# EAGLE design UM6650C (EAGLE 9.6.2)
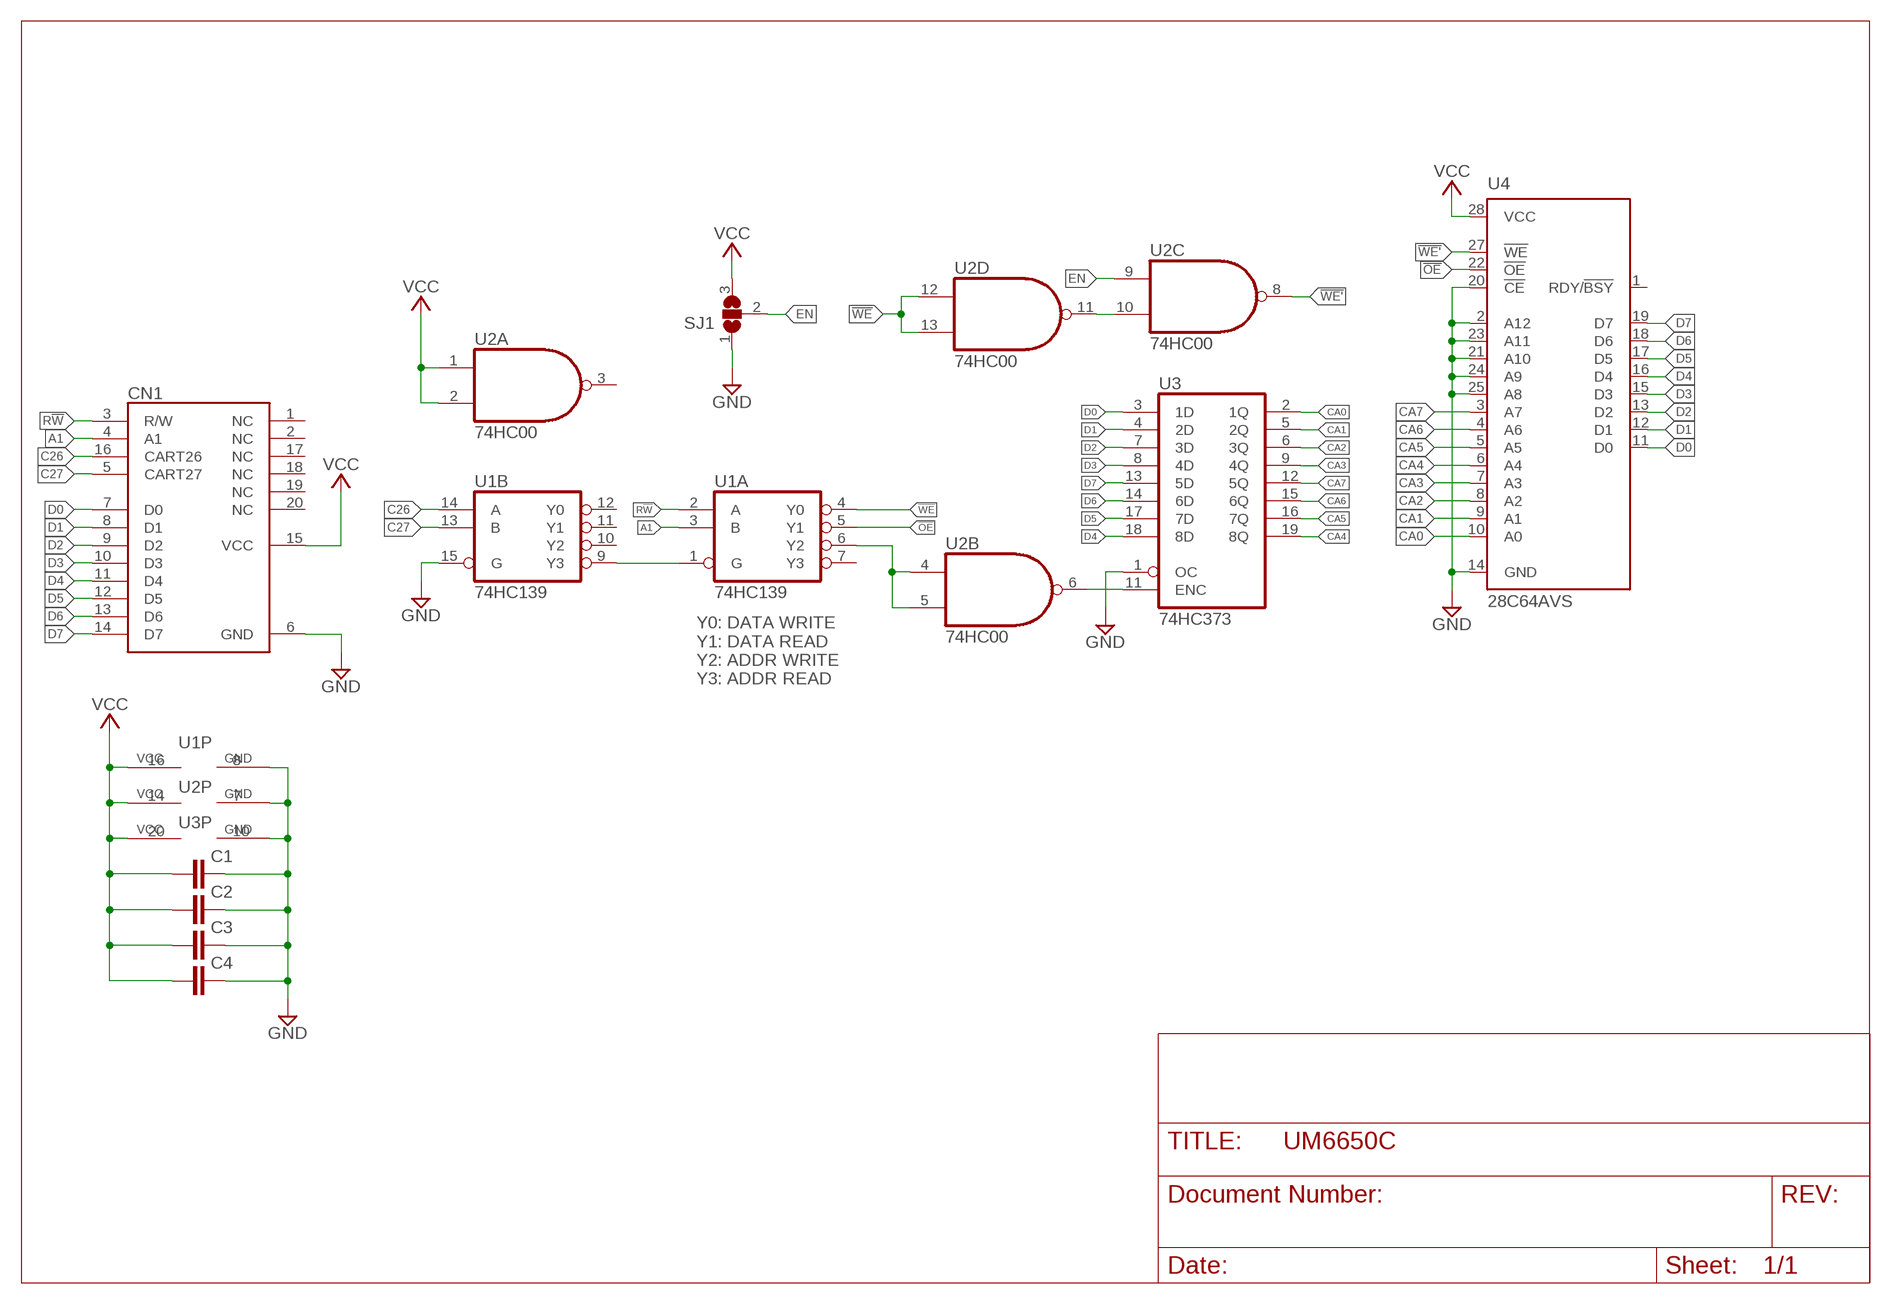
[diagram p0: schematic, sheet 1]

## Parts
C1  C-EUC0603  [C0603]
C2  C-EUC0603  [C0603]
C3  C-EUC0603  [C0603]
C4  C-EUC0603  [C0603]
CN1  UM6650  [DIL20]
SJ1  SJ2W  [SJ_2]
U1  74HC139  74139PW  [TSSOP16]
U2  74HC00  7400PW  [TSSOP14]
U3  74HC373  74373PW  [TSSOP20]
U4  28C64AVS  [VSOP28-8X13]

## Nets
!OE: U1.5(A:Y1) U4.22(!OE)
!WE: U1.4(A:Y0) U2.12(D:I0) U2.13(D:I1)
!WE': U2.8(C:O) U4.27(!WE)
A1: CN1.4(A1) U1.3(A:B)
C26: CN1.16(CART26) U1.14(B:A)
C27: CN1.5(CART27) U1.13(B:B)
CA0: U3.2(1Q) U4.10(A0)
CA1: U3.5(2Q) U4.9(A1)
CA2: U3.6(3Q) U4.8(A2)
CA3: U3.9(4Q) U4.7(A3)
CA4: U3.19(8Q) U4.6(A4)
CA5: U3.16(7Q) U4.5(A5)
CA6: U3.15(6Q) U4.4(A6)
CA7: U3.12(5Q) U4.3(A7)
D0: CN1.7(D0) U3.3(1D) U4.11(D0)
D1: CN1.8(D1) U3.4(2D) U4.12(D1)
D2: CN1.9(D2) U3.7(3D) U4.13(D2)
D3: CN1.10(D3) U3.8(4D) U4.15(D3)
D4: CN1.11(D4) U3.18(8D) U4.16(D4)
D5: CN1.12(D5) U3.17(7D) U4.17(D5)
D6: CN1.13(D6) U3.14(6D) U4.18(D6)
D7: CN1.14(D7) U3.13(5D) U4.19(D7)
EN: SJ1.2 U2.9(C:I0)
GND: C1.2 C2.2 C3.2 C4.2 CN1.6(GND) SJ1.1 U1.8(P:GND) U1.15(B:G) U2.7(P:GND) U3.1(OC) U3.10(GND) U4.2(A12) U4.14(GND) U4.20(!CE) U4.21(A10) U4.23(A11) U4.24(A9) U4.25(A8)
N$1: U2.10(C:I1) U2.11(D:O)
N$2: U1.1(A:G) U1.9(B:Y3)
N$3: U1.6(A:Y2) U2.4(B:I0) U2.5(B:I1)
N$5: U2.6(B:O) U3.11(ENC)
R!W: CN1.3(R/W) U1.2(A:A)
VCC: C1.1 C2.1 C3.1 C4.1 CN1.15(VCC) SJ1.3 U1.16(P:VCC) U2.1(A:I0) U2.2(A:I1) U2.14(P:VCC) U3.20(VCC) U4.28(VCC)
Unconnected: CN1.1(NC) CN1.2(NC) CN1.17(NC) CN1.18(NC) CN1.19(NC) CN1.20(NC) U1.7(A:Y3) U1.10(B:Y2) U1.11(B:Y1) U1.12(B:Y0) U2.3(A:O) U4.1(RDY/!BSY)

## Notes on the sheet
- Y0: DATA WRITE
  Y1: DATA READ
  Y2: ADDR WRITE
  Y3: ADDR READ

## Library data of the parts
C1-C4 = rcl:C-EU: CAPACITOR, European symbol; SPICEPREFIX: C
CN1 = acan:UM6650: UM6650
SJ1 = jumper:SJ2W: SMD solder JUMPER
U1 = 74xx-us:74*139: Dual 2-line to 4-line DECODER/DEMULTIPLEXER
U2 = 74xx-us:74*00: Quad 2-input NAND gate
U3 = 74xx-us:74*373: Octal D type transparent LATCH, edge triggered
U4 = microchip:28*64A: CMOS EEPROM 64 K (8 K x 8), low voltage; OC_FARNELL: unknown; OC_NEWARK: unknown

## Board
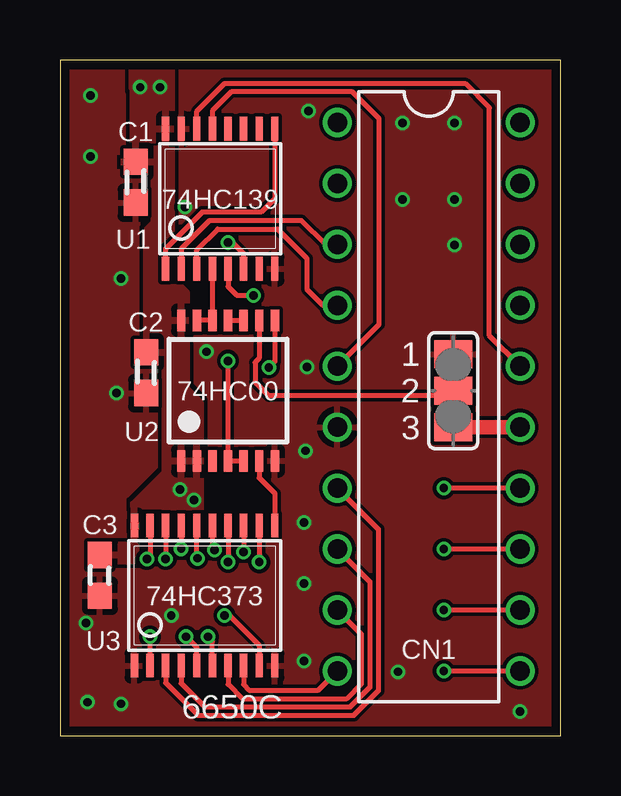
[diagram p1: board, top side]
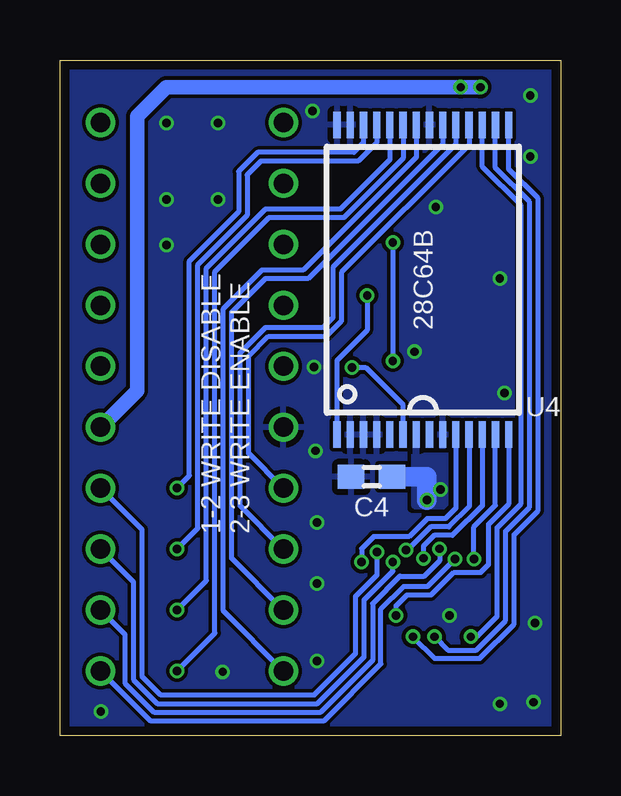
[diagram p2: board, bottom side, seen from below]

Size 20.86 x 28.16 mm. Coordinates in mm from the lower left corner, seen from the top.
Outline: 0,0 20.86,0 20.86,28.16 0,28.16 0,0
Copper layers (1*16): Top 0.035559375mm / dielectric 1.6mm / Bottom 0.035559375mm
Design rules "oshpark-2layer *": minimum track width 6mil, minimum drill 10mil, track to track 6mil, track to pad 6mil, pad to pad 6mil, via to via 6mil, smd to smd 6mil, copper to edge 15mil, drill to drill 6mil, minimum pad ring 5mil, minimum via ring 5mil, stop-mask expansion 2.5mil, vias tented up to drill 10mil, thermal gap 10mil

### Footprints (pad centres in the part's own frame; a part is rotated, then mirrored left to right if it is on the bottom)
C0603 = smd 1.1 x 1: 1 -0.85,0; 2 0.85,0
DIL20 = drill 0.813: 1 -11.43,-3.81; 2 -8.89,-3.81; 3 -6.35,-3.81; 4 -3.81,-3.81; 5 -1.27,-3.81; 6 1.27,-3.81; 7 3.81,-3.81; 8 6.35,-3.81; 9 8.89,-3.81; 10 11.43,-3.81; 11 11.43,3.81; 12 8.89,3.81; 13 6.35,3.81; 14 3.81,3.81; 15 1.27,3.81; 16 -1.27,3.81; 17 -3.81,3.81; 18 -6.35,3.81; 19 -8.89,3.81; 20 -11.43,3.81
SJ_2 = smd 1.168 x 1.6: 1 -1.524,0; 2 0,0; 3 1.524,0
TSSOP16 = smd 0.305 x 0.991: 1 -2.275,-2.918; 2 -1.625,-2.918; 3 -0.975,-2.918; 4 -0.325,-2.918; 5 0.325,-2.918; 6 0.975,-2.918; 7 1.625,-2.918; 8 2.275,-2.918; 9 2.275,2.918; 10 1.625,2.918; 11 0.975,2.918; 12 0.325,2.918; 13 -0.325,2.918; 14 -0.975,2.918; 15 -1.625,2.918; 16 -2.275,2.918
TSSOP14 = smd 0.35 x 0.9: 1 -1.95,-2.925; 2 -1.3,-2.925; 3 -0.65,-2.925; 4 0,-2.925; 5 0.65,-2.925; 6 1.3,-2.925; 7 1.95,-2.925; 8 1.95,2.925; 9 1.3,2.925; 10 0.65,2.925; 11 0,2.925; 12 -0.65,2.925; 13 -1.3,2.925; 14 -1.95,2.925
TSSOP20 = smd 0.305 x 0.991: 1 -2.925,-2.918; 2 -2.275,-2.918; 3 -1.625,-2.918; 4 -0.975,-2.918; 5 -0.325,-2.918; 6 0.325,-2.918; 7 0.975,-2.918; 8 1.625,-2.918; 9 2.275,-2.918; 10 2.925,-2.918; 11 2.925,2.918; 12 2.275,2.918; 13 1.625,2.918; 14 0.975,2.918; 15 0.325,2.918; 16 -0.325,2.918; 17 -0.975,2.918; 18 -1.625,2.918; 19 -2.275,2.918; 20 -2.925,2.918
VSOP28-8X13 = smd 0.3 x 1.1: 1 0.275,-6.45; 2 0.825,-6.45; 3 1.375,-6.45; 4 1.925,-6.45; 5 2.475,-6.45; 6 3.025,-6.45; 7 3.575,-6.45; 8 3.575,6.45; 9 3.025,6.45; 10 2.475,6.45; 11 1.925,6.45; 12 1.375,6.45; 13 0.825,6.45; 14 0.275,6.45; 15 -0.275,6.45; 16 -0.825,6.45; 17 -1.375,6.45; 18 -1.925,6.45; 19 -2.475,6.45; 20 -3.025,6.45; 21 -3.575,6.45; 22 -3.575,-6.45; 23 -3.025,-6.45; 24 -2.475,-6.45; 25 -1.925,-6.45; 26 -1.375,-6.45; 27 -0.825,-6.45; 28 -0.275,-6.45

### Placement (x,y rotation side)
C1  3.15,23.07 270 top
C2  3.59,15.13 270 top
C3  1.66,6.68 270 top
C4  7.89,10.78 180 bottom
CN1  15.37,14.13 270 top
SJ1  16.38,14.38 270 top
U1  6.67,22.38 0 top
U2  7,14.38 0 top
U3  6.03,5.84 0 top
U4  5.75,19 0 bottom

### Tracks (layer width: path | path; a pad name or v marks a point on that pad's centre or on a via)
!OE  (via drill 0.35)
  Top 0.2: U1.5 7,18.72 7.37,18.35 v8.06,18.35
  Bottom 0.2: U4.22 9.32,15.64 8.06,16.9 v8.06,18.35
!WE
  Top 0.2: U1.4 U2.12 U2.13
!WE'  (via drill 0.35)
  Top 0.2: U2.8 8.95,15.6 v8.7,15.35
  Bottom 0.2: U4.27 6.57,13.79 8.13,15.35 v8.7,15.35
A1
  Top 0.2: U1.3 5.7,20.24 6.57,21.11 9.07,21.11 10.29,19.89 10.29,18.61 10.96,17.94 CN1.4
C26
  Top 0.2: U1.14 5.7,26.02 6.86,27.18 16.88,27.18 17.89,26.16 17.89,16.68 CN1.16
C27
  Top 0.2: U1.13 6.35,26.04 7.14,26.83 12.18,26.83 13.29,25.71 13.29,17.14 CN1.5
CA0  (via drill 0.35)
  Top 0.2: U3.2 v3.75,4.13
  Bottom 0.2: v3.75,4.13 3.5,4.13 2.65,4.97 2.65,8.67 1.65,9.67 1.65,22.1 3.27,23.72 U4.10
CA1  (via drill 0.35)
  Top 0.2: U3.5 5.7,3.68 v5.25,4.13
  Bottom 0.2: U4.9 2.72,23.66 1.3,22.24 1.3,9.53 2.3,8.53 2.3,4.8 3.52,3.57 4.7,3.57 v5.25,4.13
CA2  (via drill 0.35)
  Top 0.2: U3.6 6.35,3.94 v6.16,4.13
  Bottom 0.2: U4.8 2.17,23.61 0.95,22.39 0.95,9.38 1.94,8.38 1.94,4.65 3.37,3.22 5.26,3.22 v6.16,4.13
CA3  (via drill 0.35)
  Top 0.2: v6.86,5.02 7.05,5.02 8.3,3.77 U3.9
  Bottom 0.2: U4.7 2.17,9.65 3,8.82 3,7.14 3.33,6.81 4.46,6.81 5.4,5.87 6.41,5.87 6.86,5.42 v6.86,5.02
CA4  (via drill 0.35)
  Top 0.2: U3.19 3.75,7.5 v3.62,7.37
  Bottom 0.2: v3.62,7.37 3.62,8.7 2.72,9.6 U4.6
CA5  (via drill 0.35)
  Top 0.2: v5.72,7.39 5.7,7.42 U3.16
  Bottom 0.2: v5.72,7.39 5.72,7.9 5.28,8.35 4.52,8.35 3.27,9.59 U4.5
CA6  (via drill 0.35)
  Top 0.2: U3.15 6.35,7.84 v6.44,7.75
  Bottom 0.2: v6.44,7.75 6.38,7.75 5.43,8.7 4.66,8.7 3.82,9.54 U4.4
CA7  (via drill 0.35)
  Top 0.2: U3.12 v8.3,7.23
  Bottom 0.2: v8.3,7.23 8.3,7.8 7.8,8.3 6.32,8.3 5.57,9.05 4.81,9.05 4.37,9.49 U4.3
D0
  Top 0.2: U3.3 4.4,2.2 5.76,0.85 12.25,0.85 13.27,1.87 13.27,8.61 CN1.7
  Bottom 0.2: CN1.7 13.01,11.77 13.01,15.81 12.18,16.64 9.78,16.64 9.14,17.27 9.14,19.3 3.82,24.63 U4.11
D1
  Top 0.2: U3.4 5.05,2.18 6.03,1.2 12.1,1.2 12.91,2.01 12.91,6.42 CN1.8
  Bottom 0.2: CN1.8 13.36,9.58 13.36,15.96 12.3,17.02 9.9,17.02 9.5,17.42 9.5,19.51 4.37,24.64 U4.12
D2
  Top 0.2: U3.7 7,2.14 7.59,1.55 11.96,1.55 12.56,2.16 12.56,4.23 CN1.9
  Bottom 0.2: CN1.9 13.71,7.39 13.71,17.65 12.31,19.05 10.52,19.05 4.92,24.65 U4.13
D3
  Top 0.2: U3.8 7.65,2.13 7.87,1.91 10.76,1.91 CN1.10
  Bottom 0.2: CN1.10 14.06,5.21 14.06,17.79 12.45,19.4 10.73,19.4 6.02,24.11 U4.15
D4  (via drill 0.35)
  Top 0.2: U3.18 v4.4,7.37 | CN1.11 v15.99,2.7
  Bottom 0.2: v4.4,7.37 5.54,6.22 6.55,6.22 7.49,5.28 7.49,2.99 9.85,0.64 17.11,0.64 CN1.11 | U4.16 6.57,24.06 9.04,21.59 12.17,21.59 14.41,19.34 14.41,4.27 v15.99,2.7
D5  (via drill 0.35)
  Top 0.2: U3.17 v5.05,7.79 | CN1.12 v15.99,5.24
  Bottom 0.2: v5.05,7.79 5.05,7.28 5.68,6.65 6.7,6.65 7.84,5.51 7.84,3.14 9.99,0.99 16.96,0.99 18.16,2.19 18.16,4.22 CN1.12 | U4.17 7.12,24.01 9.19,21.95 12.31,21.95 14.77,19.49 14.77,6.46 v15.99,5.24
D6  (via drill 0.35)
  Top 0.2: U3.14 v7,7.24 | CN1.13 v15.99,7.78
  Bottom 0.2: v7,7.24 7,6.86 8.2,5.66 8.2,3.28 10.14,1.34 16.81,1.34 17.81,2.33 17.81,6.41 CN1.13 | U4.18 7.67,24.71 8.45,23.94 12.5,23.94 13.07,23.37 13.07,21.69 15.12,19.64 15.12,8.65 v15.99,7.78
D7  (via drill 0.35)
  Top 0.2: U3.13 v7.65,7.67 | CN1.14 v15.99,10.32
  Bottom 0.2: v7.65,7.67 7.65,6.7 8.55,5.81 8.55,3.43 10.29,1.69 16.66,1.69 17.45,2.48 17.45,8.6 CN1.14 | U4.19 8.22,24.71 8.62,24.31 12.63,24.31 13.42,23.51 13.42,21.83 15.47,19.78 15.47,10.84 v15.99,10.32
EN
  Top 0.2: U2.9 8.3,15.73 8.13,15.56 8.13,14.73 8.7,14.16 15.62,14.16 15.84,14.38 SJ1.2
GND  (via drill 0.35)
  other vias: 10.35,26.04 10.29,15.37 14.28,25.53 1.14,1.4 2.35,14.29 1.08,4.7 4.64,5.02 2.54,1.33 19.16,1.02 10.16,6.35 10.16,3.11 10.16,8.89 6.1,16 10.22,11.87 16.43,25.53 16.43,22.35 14.28,22.35 16.43,20.45 14.09,2.67 2.54,19.05 1.27,24.13 1.27,26.67 5.21,22.03
  pour Top (rank 6): -1.27,29.21 21.59,29.21 21.59,-1.27 -1.27,-1.27
  pour Bottom (isolate 0.127, rank 6): -1.27,29.21 21.59,29.21 21.59,-1.27 -1.27,-1.27
N$1
  Top 0.2: U2.11 U2.10
N$2
  Top 0.2: U1.1 4.4,20.3 5.92,21.82 8.38,21.82 8.95,22.38 U1.9
N$3  (via drill 0.35)
  Top 0.2: U2.5 U2.4 v7,15.62 | U1.6 7.65,20.08 7.18,20.56 v7,20.56
  Bottom 0.2: v7,20.56 v7,15.62
N$5
  Top 0.2: U2.6 8.3,10.75 8.95,10.1 U3.11
R!W
  Top 0.2: U1.2 5.05,20.29 6.22,21.46 10.06,21.46 11.05,20.48 CN1.3
VCC  (via drill 0.35)
  Top 0.61: CN1.15 SJ1.3
  Bottom 0.61: CN1.15 17.65,14.38 17.65,25.8 16.43,27.02 v4.17,27.02 v3.34,27.02
  Bottom 0.813: C4.1 5.58,10.78 v5.58,9.82
  other vias: 5,10.27
  pour Top: 4.64,28.13 4.64,20.87 4.45,20.68 4.45,19.3 5.27,18.48 5.27,14.48 5.84,13.91 5.84,9.33 5.59,9.08 4.38,9.08 4.38,15.62 3.62,15.62 3.62,21.08 3.94,21.4 3.94,26.04 3.02,26.96 3.02,28.13
  pour Bottom (isolate 0.2): 4.76,12.19 6.1,12.19 6.1,9.59 4.76,9.59
  pour Top: 1.33,7.3 3.11,7.3 3.17,7.37 3.17,9.14 3.62,9.59 5.71,9.59 5.71,10.99 4.38,10.99 3.05,9.65 3.05,8.26 2.73,7.94 1.33,7.94
  pour Top: 2.67,24.45 3.05,24.83 3.05,26.99 4.57,26.99 4.57,23.81 2.67,23.81

### Text on the board
tPlace: 1 / 2 / 3 | 6650C
bPlace: 28C64B | 1-2 WRITE DISABLE / 2-3 WRITE ENABLE